# EAGLE schematic simon (EAGLE 6.4)
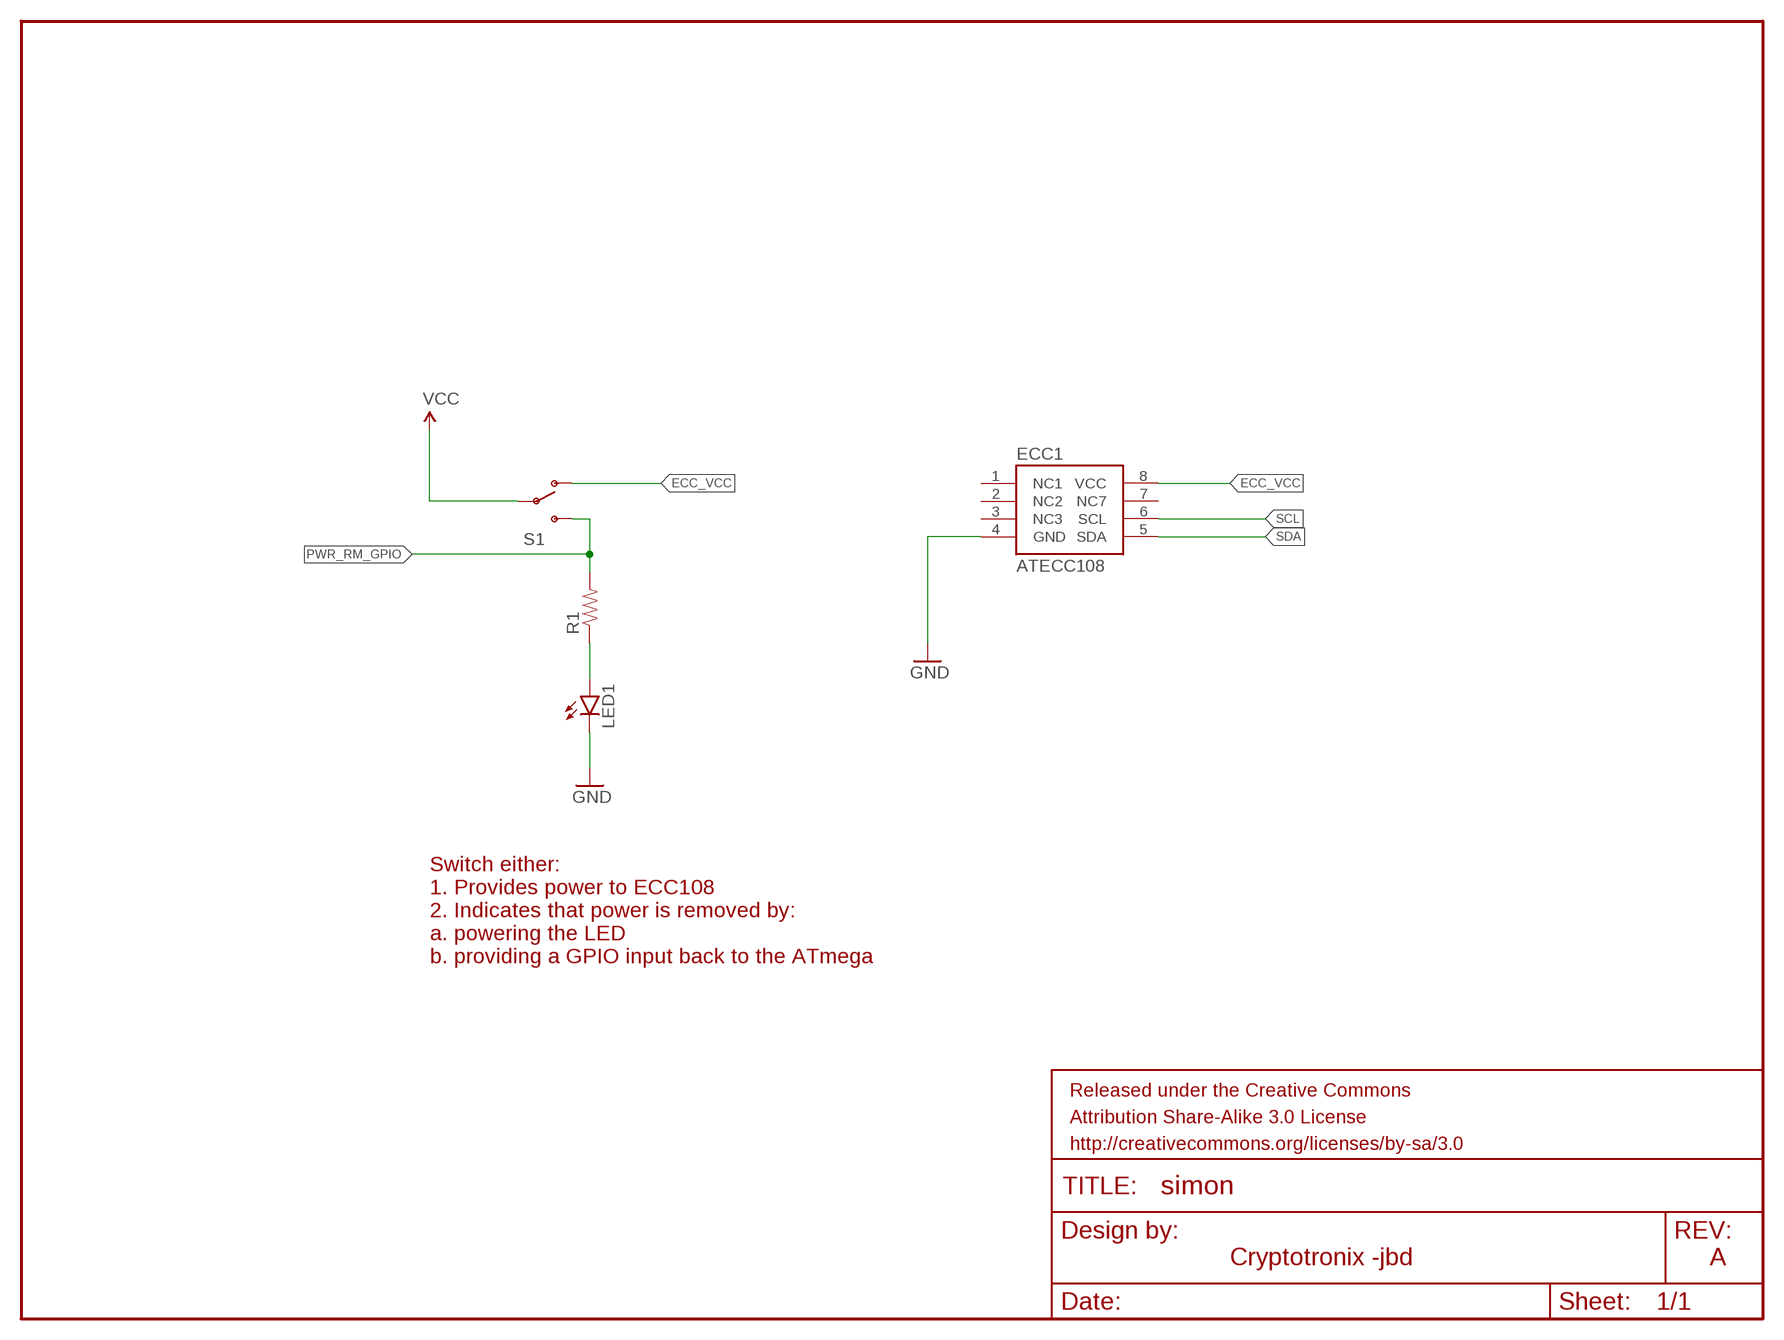
[diagram p0: schematic, sheet 1]

## Parts
ECC1  ATECC108  [SOIC8]
FRAME1  FRAME-LETTER  [CREATIVE_COMMONS]
LED1  LED0603  [LED-0603]
R1  RESISTOR0603  [0603-RES]
S1  SWITCH-SPDT-SMD-A  [SWITCH-SPST-SMD-A]

## Nets
ECC_VCC: ECC1.8(VCC) S1.1(O)
GND: ECC1.4(GND) LED1.C
N$4: LED1.A R1.1
PWR_RM_GPIO: R1.2 S1.3(S)
SCL: ECC1.6(SCL)
SDA: ECC1.5(SDA)
VCC: S1.2(P)
Unconnected: ECC1.1(NC1) ECC1.2(NC2) ECC1.3(NC3) ECC1.7(NC7)

## Notes on the sheet
- Switch either:
  1. Provides power to ECC108
  2. Indicates that power is removed by:
  a. powering the LED
  b. providing a GPIO input back to the ATmega
- Cryptotronix -jbd | A

## Library data of the parts
ECC1 = cryptotronix:ATECC108: ATECC108: Provides ECDSA with NIST curves P256, B283, and K283. Also, a RNG, 8.5Kb EEPROM. 2.0V - 5.5V.
FRAME1 = SparkFun-Aesthetics:FRAME-LETTER: Schematic Frame Standard 8.5x11 US Letter frame
LED1 = SparkFun-LED:LED: LEDs Standard schematic elements and footprints for 5mm, 3mm, 1206, and 0603 sized LEDs. 5mm - Spark Fun Electronics SKU : COM-00529 (and others)
R1 = SparkFun-Resistors:RESISTOR: Resistor Basic schematic elements and footprints for 0603, 1206, and PTH resistors.
S1 = SparkFun-Electromechanical:SWITCH-SPDT: SPDT Switch Simple slide switch, Spark Fun Electronics SKU : COM-00102 DPDT SMT slide switch, AYZ0202, SWCH-08179